# EAGLE design shieldArduinoMega (EAGLE 6.1)
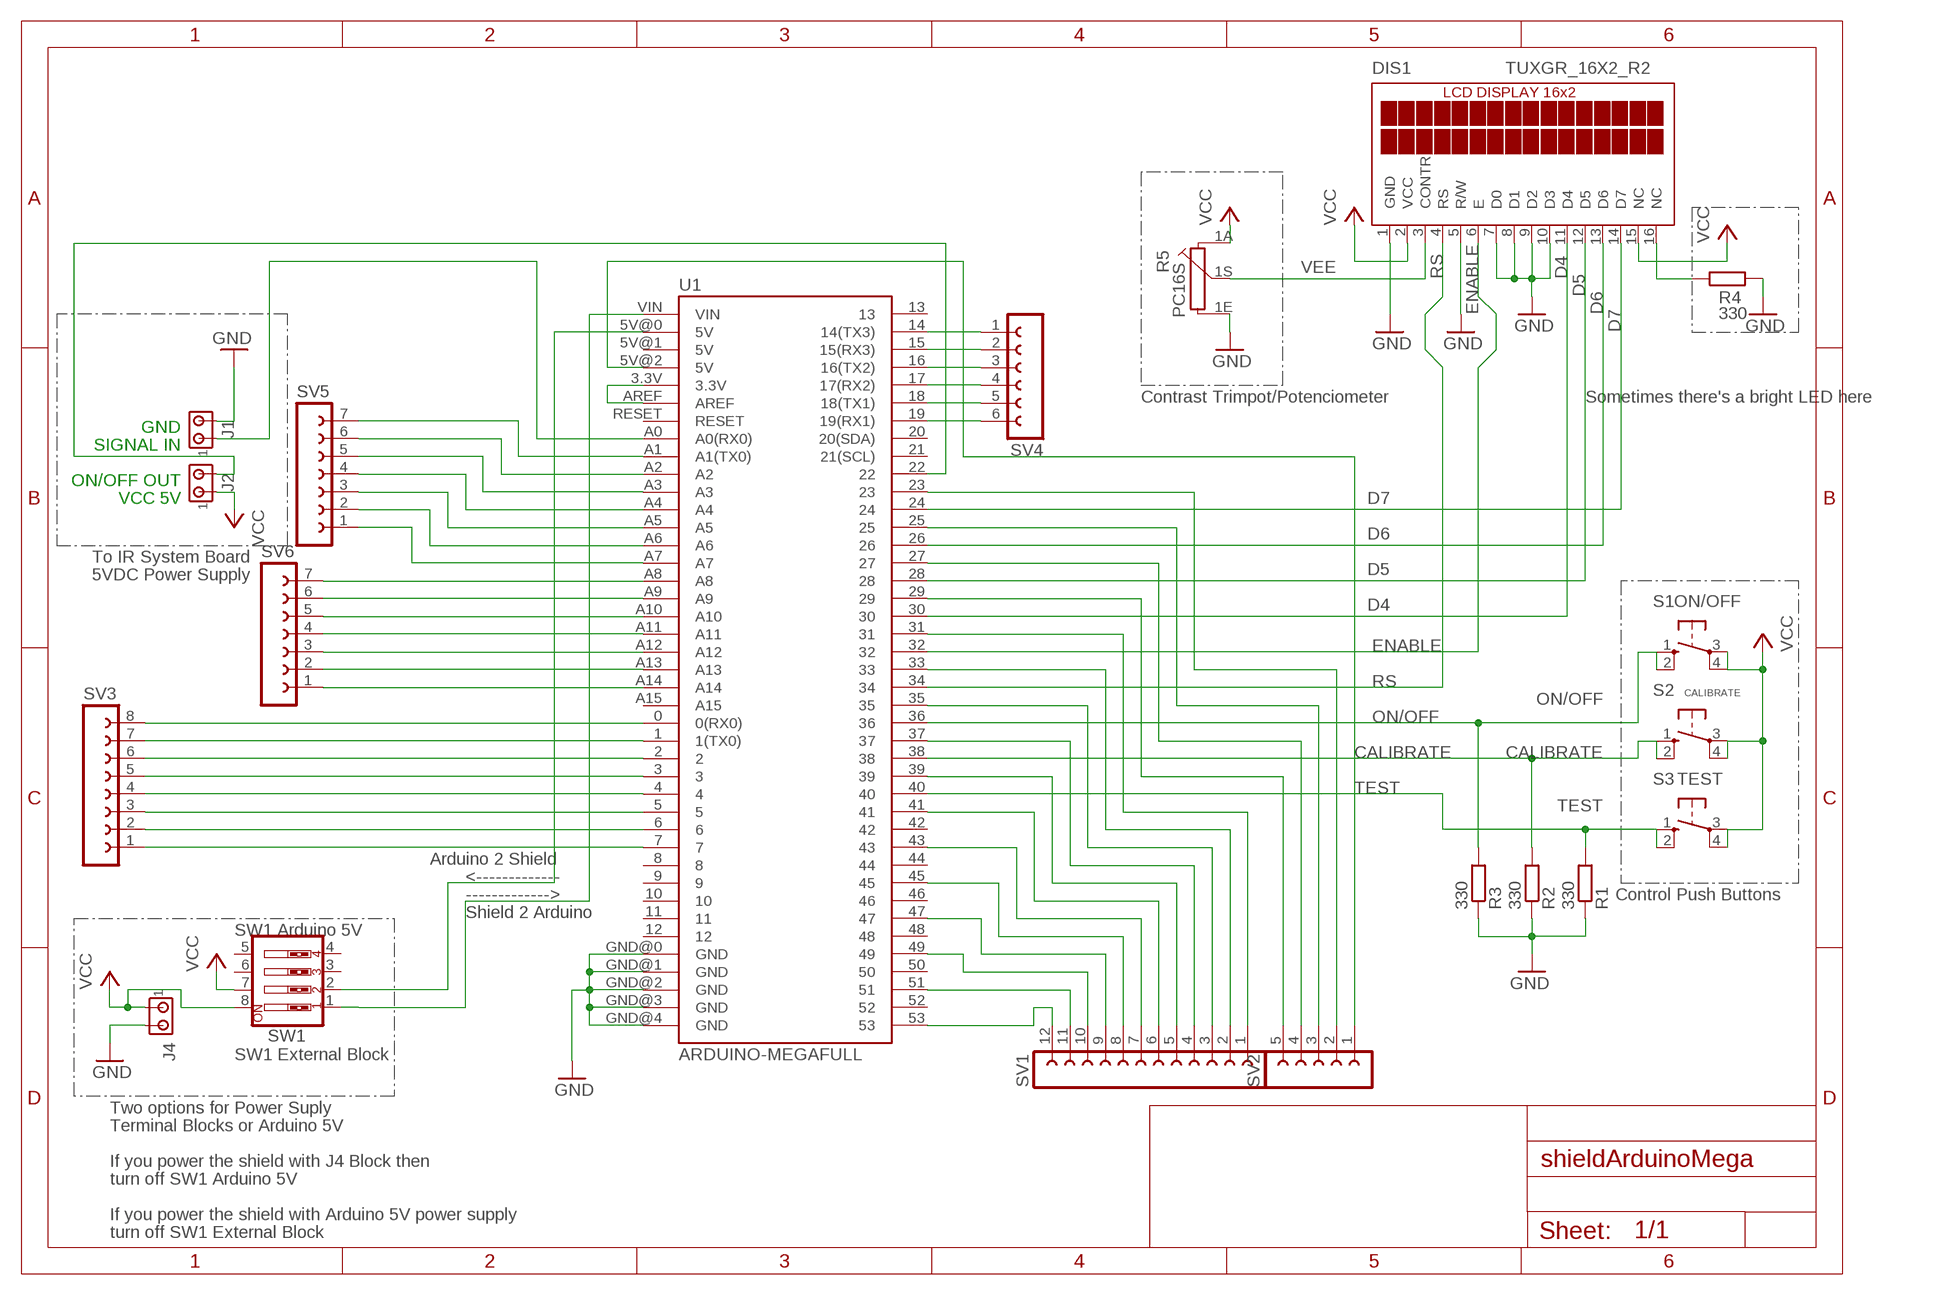
[diagram p0: schematic, sheet 1]

## Parts
DIS1  TUXGR_16X2_R2  [TUXGR_16X2_R2]
J1  MTA02-156  [1X2MTA]
J2  MTA02-156  [1X2MTA]
J4  MTA02-156  [1X2MTA]
R1  330  R-EU_0204/7  [0204/7]
R2  330  R-EU_0204/7  [0204/7]
R3  330  R-EU_0204/7  [0204/7]
R4  330  R-EU_0204/7  [0204/7]
R5  PC16S  [PC16S]
S1  ON/OFF  10-XX  [B3F-10XX]
S2  CALIBRATE  10-XX  [B3F-10XX]
S3  TEST  10-XX  [B3F-10XX]
SV1  FE12-1  [FE12]
SV2  FE05-1  [FE05-1]
SV3  FE08-1  [FE08]
SV4  FE06-1  [FE06]
SV5  FE07-1  [FE07]
SV6  FE07-1  [FE07]
SW1  SW_DIP-4  [EDG-04]
U1  ARDUINO-MEGAFULL  [ARDUINO_MEGA]

## Nets
3.3: U1.3.3V U1.AREF
CALIBRATE: R2.2 S2.1(S) S2.2(S1) U1.38
D4: DIS1.11(D4) U1.30
D5: DIS1.12(D5) U1.28
D6: DIS1.13(D6) U1.26
D7: DIS1.14(D7) U1.24
ENABLE: DIS1.6(E) U1.32
GND: DIS1.1(GND) DIS1.5(R/W) DIS1.7(D0) DIS1.8(D1) DIS1.9(D2) DIS1.10(D3) J1.2 J4.2 R1.1 R2.1 R3.1 R4.2 R5.1E U1.GND@0(GND) U1.GND@1(GND) U1.GND@2(GND) U1.GND@3(GND) U1.GND@4(GND)
IR_ON/OFF: J2.2 U1.22
LED-: DIS1.16(NC) R4.1
N$1: SV1.12 U1.53
N$2: SW1.1 U1.VIN
N$3: SV1.11 U1.51
N$4: SW1.2 U1.5V@0(5V)
N$5: SV1.10 U1.49
N$6: SV1.9 U1.47
N$7: SV1.8 U1.45
N$8: SV1.7 U1.43
N$9: SV1.6 U1.41
N$10: SV1.5 U1.39
N$11: SV1.4 U1.37
N$12: SV1.3 U1.35
N$13: SV1.2 U1.33
N$14: SV1.1 U1.31
N$15: SV2.5 U1.29
N$16: SV2.4 U1.27
N$17: SV2.3 U1.25
N$18: SV2.2 U1.23
N$19: SV2.1 U1.5V@2(5V)
N$20: SV3.8 U1.0(0(RX0))
N$21: SV3.7 U1.1(1(TX0))
N$22: SV3.6 U1.2
N$23: SV3.5 U1.3
N$24: SV3.4 U1.4
N$25: SV3.3 U1.5
N$26: SV3.2 U1.6
N$27: SV3.1 U1.7
N$28: SV4.1 U1.14(14(TX3))
N$29: SV4.2 U1.15(15(RX3))
N$30: SV4.3 U1.16(16(TX2))
N$31: SV4.4 U1.17(17(RX2))
N$32: SV4.5 U1.18(18(TX1))
N$33: SV4.6 U1.19(19(RX1))
N$34: SV5.7 U1.A1(A1(TX0))
N$35: SV5.6 U1.A2
N$36: SV5.5 U1.A3
N$37: SV5.4 U1.A4
N$38: SV5.3 U1.A5
N$39: SV5.2 U1.A6
N$40: SV5.1 U1.A7
N$41: SV6.7 U1.A8
N$42: SV6.6 U1.A9
N$43: SV6.5 U1.A10
N$44: SV6.4 U1.A11
N$45: SV6.3 U1.A12
N$46: SV6.2 U1.A13
N$47: SV6.1 U1.A14
ON/OFF: R3.2 S1.1(S) S1.2(S1) U1.36
RS: DIS1.4(RS) U1.34
SIGNAL_IN: J1.1 U1.A0(A0(RX0))
TEST: R1.2 S3.1(S) S3.2(S1) U1.40
VCC: DIS1.2(VCC) DIS1.15(NC) J2.1 J4.1 R5.1A S1.3(P) S1.4(P1) S2.3(P) S2.4(P1) S3.3(P) S3.4(P1) SW1.7 SW1.8
VEE: DIS1.3(CONTR) R5.1S
Unconnected: SW1.3 SW1.4 SW1.5 SW1.6 U1.5V@1(5V) U1.8 U1.9 U1.10 U1.11 U1.12 U1.13 U1.20(20(SDA)) U1.21(21(SCL)) U1.42 U1.44 U1.46 U1.48 U1.50 U1.52 U1.A15 U1.RESET

## Notes on the sheet
- Contrast Trimpot/Potenciometer | Sometimes there's a bright LED here
- GND
- SIGNAL IN
- ON/OFF OUT
- VCC 5V
- To IR System Board
- 5VDC Power Supply
- Arduino 2 Shield
- <-------------
- -------------> | Control Push Buttons
- Shield 2 Arduino
- SW1 Arduino 5V
- SW1 External Block
- Two options for Power Suply
- Terminal Blocks or Arduino 5V
- If you power the shield with J4 Block then
- turn off SW1 Arduino 5V
- If you power the shield with Arduino 5V power supply
- turn off SW1 External Block

## Library data of the parts
DIS1 = display-lcd:TUXGR_16X2_R2: Tuxgraphics LCD display 16x2 characters reflective, without background light Source: tuxgr_12x2_r2.pdf; OC_FARNELL: unknown; OC_NEWARK: unknown
J1 J2 J4 = con-amp:MTA02-156: AMP connector
R1-R3 = resistor:R-EU_: RESISTOR, European symbol
R4 = rcl:R-EU_: RESISTOR, European symbol
R5 = piher:PC16S: POTENTIOMETER single carbon potentiometer, 16 mm, S3ROH; OC_FARNELL: 4452940; OC_NEWARK: unknown
S1-S3 = switch-omron:10-XX: OMRON SWITCH; MPN: B3F-1000; OC_FARNELL: 176432; OC_NEWARK: 36M3542
SV1 = con-lsta:FE12-1: FEMALE HEADER; OC_FARNELL: unknown; OC_NEWARK: unknown
SV2 = con-lsta:FE05-1: FEMALE HEADER; OC_FARNELL: unknown; OC_NEWARK: unknown
SV3 = con-lsta:FE08-1: FEMALE HEADER; OC_FARNELL: unknown; OC_NEWARK: unknown
SV4 = con-lsta:FE06-1: FEMALE HEADER; OC_FARNELL: unknown; OC_NEWARK: unknown
SV5 SV6 = con-lsta:FE07-1: FEMALE HEADER; OC_FARNELL: unknown; OC_NEWARK: unknown
SW1 = special:SW_DIP-4: DIP SWITCH
U1 = SparkFun-Boards:ARDUINO-MEGA: Arduino Mega board footprint

## Board
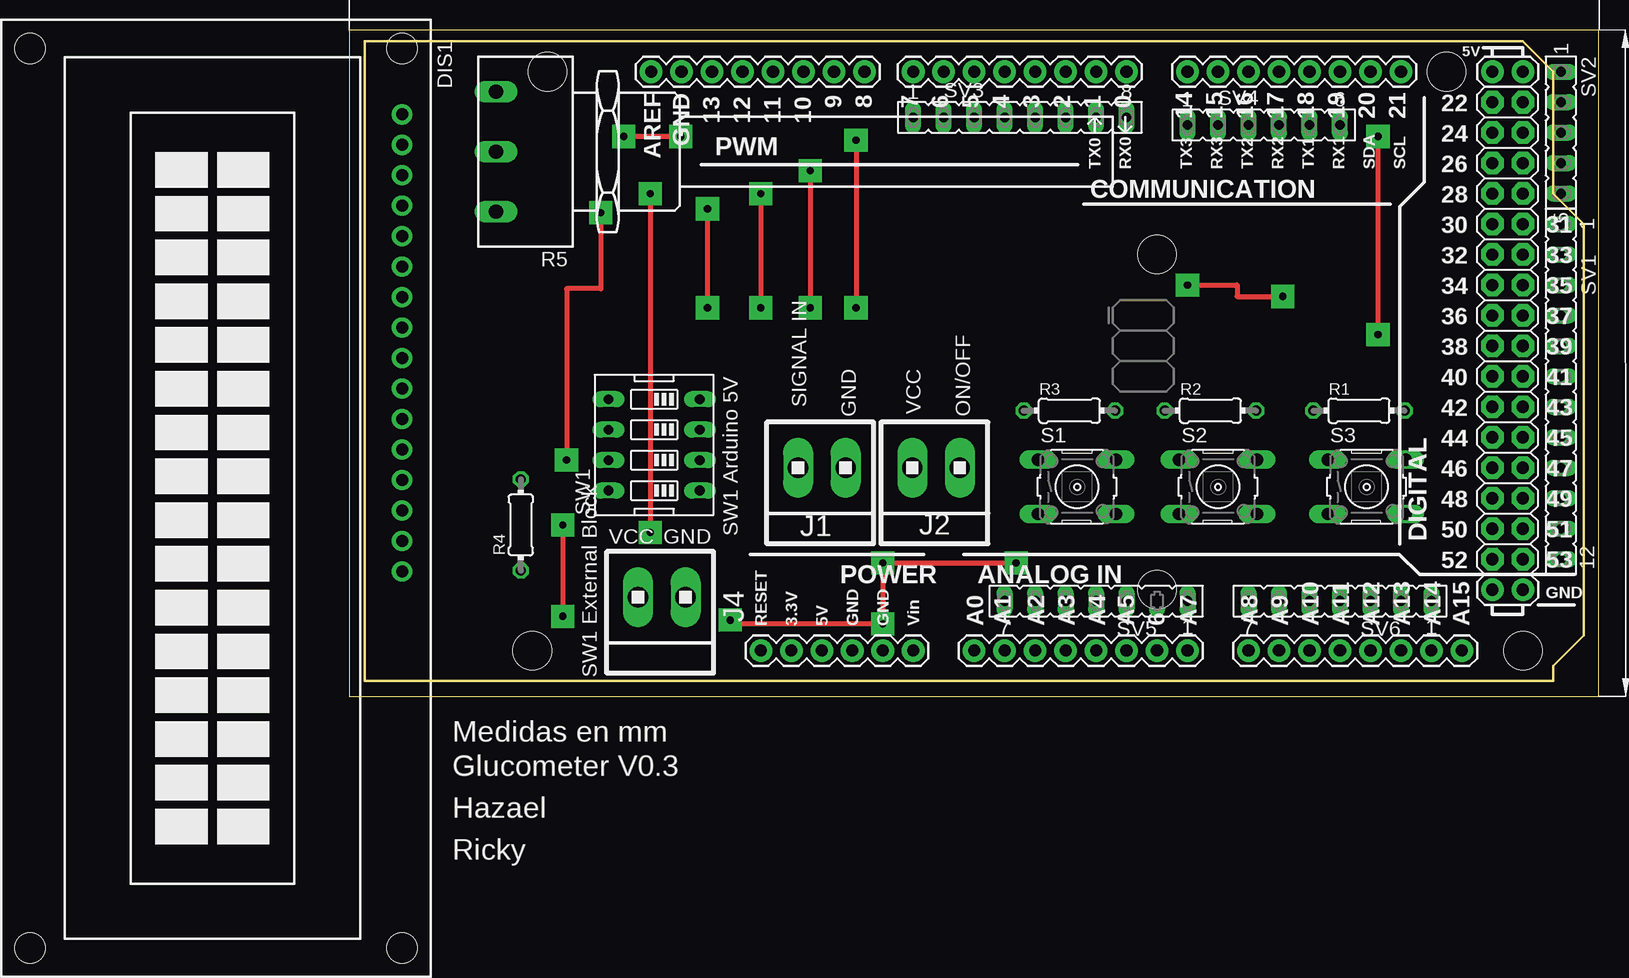
[diagram p1: board, top side]
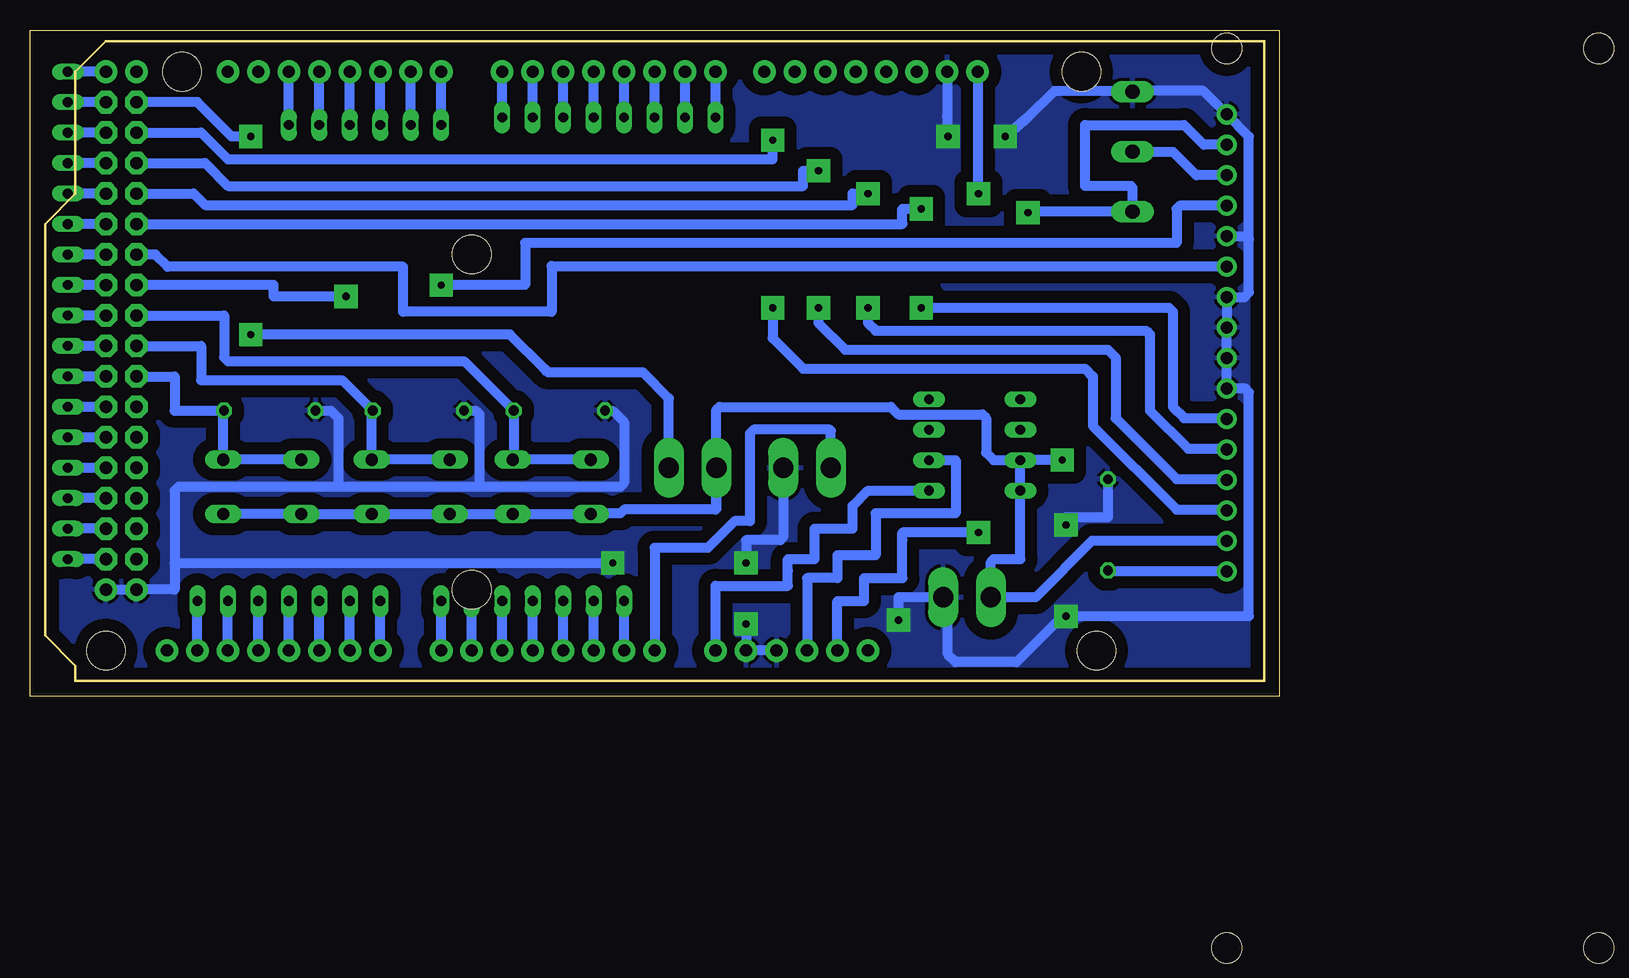
[diagram p2: board, bottom side, seen from below]

Size 104.12 x 55.55 mm. Coordinates in mm from the lower left corner, seen from the top.
Outline: 0,0 104.12,0 104.12,55.55 0,55.55 0,0
Copper layers (1*16): Top 0.035mm / dielectric 1.5mm / Bottom 0.035mm
Design rules: minimum track width 10mil, minimum drill 24mil, track to track 8mil, track to pad 8mil, pad to pad 8mil, via to via 8mil, smd to smd 8mil, copper to edge 40mil, drill to drill 8mil, minimum pad ring 10mil, minimum via ring 8mil, stop-mask expansion 4mil, vias tented up to drill 0mil, thermal gap 10mil

### Footprints (pad centres in the part's own frame; a part is rotated, then mirrored left to right if it is on the bottom)
TUXGR_16X2_R2 = drill 1 pad 1.676: 1 -32,15.5; 2 -29.46,15.5; 3 -26.92,15.5; 4 -24.38,15.5; 5 -21.84,15.5; 6 -19.3,15.5; 7 -16.76,15.5; 8 -14.22,15.5; 9 -11.68,15.5; 10 -9.14,15.5; 11 -6.6,15.5; 12 -4.06,15.5; 13 -1.52,15.5; 14 1.02,15.5; 15 3.56,15.5; 16 6.1,15.5 | hole 2.5: -37.5,-15.5; 37.5,-15.5; -37.5,15.5; 37.5,15.5
1X2MTA = drill 1.676 long: 1 1.981,0; 2 -1.981,0
0204/7 = drill 0.813 octagon: 1 -3.81,0; 2 3.81,0
PC16S = drill 1.2 long: 1A -5,6.5; 1E 5,6.5; 1S 0,6.5
B3F-10XX = drill 1.016 long: 1 -3.251,2.261; 2 3.251,2.261; 3 -3.251,-2.261; 4 3.251,-2.261
FE12 = drill 0.813 long: 1 -13.97,0; 2 -11.43,0; 3 -8.89,0; 4 -6.35,0; 5 -3.81,0; 6 -1.27,0; 7 1.27,0; 8 3.81,0; 9 6.35,0; 10 8.89,0; 11 11.43,0; 12 13.97,0
FE05-1 = drill 0.813 long: 1 -5.08,0; 2 -2.54,0; 3 0,0; 4 2.54,0; 5 5.08,0
FE08 = drill 0.813 long: 1 -8.89,0; 2 -6.35,0; 3 -3.81,0; 4 -1.27,0; 5 1.27,0; 6 3.81,0; 7 6.35,0; 8 8.89,0
FE06 = drill 0.813 long: 1 -6.35,0; 2 -3.81,0; 3 -1.27,0; 4 1.27,0; 5 3.81,0; 6 6.35,0
FE07 = drill 0.813 long: 1 -7.62,0; 2 -5.08,0; 3 -2.54,0; 4 0,0; 5 2.54,0; 6 5.08,0; 7 7.62,0
EDG-04 = drill 0.813 long: 1 -3.81,-3.81; 2 -1.27,-3.81; 3 1.27,-3.81; 4 3.81,-3.81; 5 3.81,3.81; 6 1.27,3.81; 7 -1.27,3.81; 8 -3.81,3.81
ARDUINO_MEGA = drill 1.016 pad 1.88: 0 63.5,50.8; 1 60.96,50.8; 2 58.42,50.8; 3 55.88,50.8; 3.3V 35.56,2.54; 4 53.34,50.8; 5 50.8,50.8; 5V@0 38.1,2.54; 5V@1 93.98,50.8; 5V@2 96.52,50.8; 6 48.26,50.8; 7 45.72,50.8; 8 41.656,50.8; 9 39.116,50.8; 10 36.576,50.8; 11 34.036,50.8; 12 31.496,50.8; 13 28.956,50.8; 14 68.58,50.8; 15 71.12,50.8; 16 73.66,50.8; 17 76.2,50.8; 18 78.74,50.8; 19 81.28,50.8; 20 83.82,50.8; 21 86.36,50.8; A0 50.8,2.54; A1 53.34,2.54; A2 55.88,2.54; A3 58.42,2.54; A4 60.96,2.54; A5 63.5,2.54; A6 66.04,2.54; A7 68.58,2.54; A8 73.66,2.54; A9 76.2,2.54; A10 78.74,2.54; A11 81.28,2.54; A12 83.82,2.54; A13 86.36,2.54; A14 88.9,2.54; A15 91.44,2.54; AREF 23.876,50.8; GND@0 40.64,2.54; GND@1 43.18,2.54; GND@2 93.98,7.62; GND@3 96.52,7.62; GND@4 26.416,50.8; RESET 33.02,2.54; VIN 45.72,2.54 | drill 1.016 pad 1.88 octagon: 22 93.98,48.26; 23 96.52,48.26; 24 93.98,45.72; 25 96.52,45.72; 26 93.98,43.18; 27 96.52,43.18; 28 93.98,40.64; 29 96.52,40.64; 30 93.98,38.1; 31 96.52,38.1; 32 93.98,35.56; 33 96.52,35.56; 34 93.98,33.02; 35 96.52,33.02; 36 93.98,30.48; 37 96.52,30.48; 38 93.98,27.94; 39 96.52,27.94; 40 93.98,25.4; 41 96.52,25.4; 42 93.98,22.86; 43 96.52,22.86; 44 93.98,20.32; 45 96.52,20.32; 46 93.98,17.78; 47 96.52,17.78; 48 93.98,15.24; 49 96.52,15.24; 50 93.98,12.7; 51 96.52,12.7; 52 93.98,10.16; 53 96.52,10.16 | hole 3.2: 15.24,50.8; 13.97,2.54; 66.04,35.56; 66.04,7.62; 90.17,50.8; 96.52,2.54

### Placement (x,y rotation side)
DIS1  -11.11,16.51 270 top
J1  39.37,19.05 180 top
J2  48.9,19.05 180 top
J4  26.04,8.26 180 top
R1  84.14,23.81 0 top
R2  71.75,23.81 0 top
R3  60.01,23.81 0 top
R4  14.29,14.29 90 top
R5  18.73,45.4 90 top
S1  60.64,17.46 0 top
S2  72.39,17.46 0 top
S3  84.77,17.46 0 top
SV1  100.97,25.4 270 top
SV2  100.97,46.99 270 top
SV3  55.88,48.26 0 top
SV4  76.2,47.62 0 top
SV5  62.23,7.94 180 top
SV6  82.55,7.94 180 top
SW1  25.4,20.95 90 top
U1  1.27,1.27 0 top

### Tracks (layer width: path | path; a pad name or v marks a point on that pad's centre or on a via)
3.3  (via drill 0.6 pad 1.93)
  Top 0.406: v25.08,41.91 25.08,33.66 v25.08,13.65
  Bottom 0.406: 25.15,41.97 v25.08,41.91
  Bottom 0.813: U1.AREF 25.15,41.97 | U1.3.3V 36.83,7.94 34.61,7.94 34.61,9.84 31.43,9.84 31.43,13.02 31.43,13.65 v25.08,13.65
CALIBRATE
  Bottom 0.406: 75.64,23.74 R2.2
  Bottom 0.813: S2.1 S2.2 75.64,23.74 | U1.38 89.85,29.21 89.85,26.35 78.11,26.35 R2.2
D4  (via drill 0.6 pad 1.93)
  Top 0.406: v29.84,40.64 v29.84,32.38
  Bottom 0.406: 4.46,23.18 DIS1.11
  Bottom 0.813: U1.30 31.43,39.37 31.43,40.64 v29.84,40.64 | v29.84,32.38 9.21,32.38 8.89,32.07 8.89,24.13 7.94,23.18 4.46,23.18
D5  (via drill 0.6 pad 1.93)
  Top 0.406: v34.29,41.91 v34.29,32.38
  Bottom 0.406: 4.46,20.64 DIS1.12
  Bottom 0.813: v34.29,41.91 35.56,41.91 35.56,40.96 89.53,40.96 90.49,41.91 U1.28 | v34.29,32.38 34.29,31.11 33.66,30.48 11.11,30.48 10.79,30.16 10.79,23.81 7.62,20.64 4.46,20.64
D6  (via drill 0.6 pad 1.93)
  Top 0.406: v38.42,43.81 v38.42,32.38
  Bottom 0.406: 4.46,18.1 DIS1.13
  Bottom 0.813: U1.26 89.53,44.45 87.63,42.55 39.69,42.55 39.69,43.81 v38.42,43.81 | v38.42,32.38 38.42,31.11 36.2,28.89 14.29,28.89 13.65,28.26 13.65,23.18 8.57,18.1 4.46,18.1
D7  (via drill 0.6 pad 1.93)
  Top 0.406: v42.23,46.35 v42.23,32.38
  Bottom 0.406: 4.46,15.56 DIS1.14
  Bottom 0.813: U1.24 89.85,46.99 87.63,44.77 42.23,44.77 v42.23,46.35 | v42.23,32.38 42.23,29.84 39.69,27.3 16.19,27.3 15.56,26.67 15.56,22.54 8.57,15.56 4.46,15.56
ENABLE
  Bottom 0.406: 4.39,35.88 DIS1.6
  Bottom 0.813: U1.32 93.66,36.83 92.64,35.81 73.03,35.81 73.03,32.07 60.64,32.07 60.64,35.88 4.39,35.88
GND  (via drill 0.6 pad 1.93)
  Top 0.406: v17.78,14.29 v17.78,6.67 | v31.75,6.35 32.07,6.03 v44.45,6.03 v44.45,11.11 v55.56,11.11 | v27.62,46.67 v22.86,46.67
  Bottom 0.406: 27.62,7.86 J4.2 | v17.78,6.67 18.1,6.67 | 44.37,11.04 v44.45,11.11 | 94.93,8.89 U1.GND@2 94.93,8.89
  Bottom 0.813: U1.GND@0 U1.GND@1 v44.45,6.03 | J4.2 31.75,8.26 v31.75,6.35 | DIS1.8 DIS1.9 DIS1.10 | 27.62,7.86 27.62,3.49 26.99,2.86 21.91,2.86 18.1,6.67 | R4.2 14.29,14.92 17.78,14.92 v17.78,14.29 | v17.78,6.67 2.54,6.67 2.54,25.33 2.86,25.65 | U1.GND@3 U1.GND@2 | 92.08,11.11 92.08,8.89 94.93,8.89 | 92.08,11.11 v55.56,11.11 | R3.1 55.56,23.81 54.61,22.86 54.61,17.78 54.93,17.46 66.67,17.46 | 66.67,17.46 78.42,17.46 | 78.42,17.46 91.76,17.46 92.08,17.14 92.08,11.11 | R1.1 79.06,23.81 78.42,23.18 78.42,17.46 | R2.1 66.99,23.81 66.67,23.5 66.67,17.46 | J1.2 41.35,13.26 41.59,13.02 44.45,13.02 v44.45,11.11 | 2.79,25.65 2.86,25.65 | 2.86,25.65 4.38,25.65 4.45,25.72 | DIS1.7 2.92,33.27 2.54,33.66 2.54,38.1 | 2.54,38.1 2.54,46.66 DIS1.1 6.35,50.48 12.15,50.48 R5.1E 12.31,50.48 18.73,50.48 20.95,48.26 v22.86,46.67 | DIS1.5 2.79,38.35 2.54,38.1 | U1.GND@4 27.69,48.32 v27.62,46.67
  Bottom 0.82: DIS1.7 DIS1.8
  pour Bottom (isolate 1.016): 103.82,5.4 100.01,1.59 1.59,1.59 1.59,54.29 101.92,54.61 103.82,54.61
IR_ON/OFF  (via drill 0.6 pad 1.93)
  Top 0.406: v85.72,30.16 v85.72,46.67
  Bottom 0.813: J2.2 50.88,24.84 53.02,26.99 60.96,26.99 61.28,27.3 64.14,30.16 v85.72,30.16 | v85.72,46.67 87.31,46.67 90.17,49.53 U1.22
LED-
  Bottom 0.406: 14.22,10.41 R4.1
  Bottom 0.813: DIS1.16 14.22,10.41
N$1
  Bottom 0.813: U1.53 SV1.12
N$2
  Bottom 0.813: U1.VIN 46.99,9.21 40.96,9.21 40.96,10.48 40.96,11.43 38.73,11.43 38.73,13.97 35.56,13.97 35.56,15.88 34.29,17.14 SW1.1
N$3
  Bottom 0.813: U1.51 SV1.11
N$4
  Bottom 0.813: SW1.2 26.99,19.68 26.99,15.24 33.66,15.24 33.66,11.75 36.83,11.75 36.83,9.84 39.37,9.84 U1.5V@0
N$5
  Bottom 0.813: U1.49 SV1.10
N$6
  Bottom 0.813: U1.47 SV1.9
N$7
  Bottom 0.813: U1.45 SV1.8
N$8
  Bottom 0.813: U1.43 SV1.7
N$9
  Bottom 0.813: U1.41 SV1.6
N$10
  Bottom 0.813: U1.39 SV1.5
N$11
  Bottom 0.813: U1.37 SV1.4
N$12
  Bottom 0.813: U1.35 SV1.3
N$13
  Bottom 0.813: U1.33 SV1.2
N$14
  Bottom 0.813: U1.31 SV1.1
N$15
  Bottom 0.813: U1.29 SV2.5
N$16
  Bottom 0.813: U1.27 SV2.4
N$17
  Bottom 0.813: U1.25 SV2.3
N$18
  Bottom 0.813: U1.23 SV2.2
N$19
  Bottom 0.813: U1.5V@2 SV2.1
N$20
  Bottom 0.813: SV3.8 U1.0
N$21
  Bottom 0.813: SV3.7 U1.1
N$22
  Bottom 0.813: SV3.6 U1.2
N$23
  Bottom 0.813: SV3.5 U1.3
N$24
  Bottom 0.813: SV3.4 U1.4
N$25
  Bottom 0.813: SV3.3 U1.5
N$26
  Bottom 0.813: SV3.2 U1.6
N$27
  Bottom 0.813: SV3.1 U1.7
N$28
  Bottom 0.813: SV4.1 U1.14
N$29
  Bottom 0.813: SV4.2 U1.15
N$30
  Bottom 0.813: SV4.3 U1.16
N$31
  Bottom 0.813: SV4.4 U1.17
N$32
  Bottom 0.813: SV4.5 U1.18
N$33
  Bottom 0.813: SV4.6 U1.19
N$34
  Bottom 0.813: U1.A1 SV5.7
N$35
  Bottom 0.813: U1.A2 SV5.6
N$36
  Bottom 0.813: U1.A3 SV5.5
N$37
  Bottom 0.813: U1.A4 SV5.4
N$38
  Bottom 0.813: U1.A5 SV5.3
N$39
  Bottom 0.813: U1.A6 SV5.2
N$40
  Bottom 0.813: U1.A7 SV5.1
N$41
  Bottom 0.813: U1.A8 SV6.7
N$42
  Bottom 0.813: U1.A9 SV6.6
N$43
  Bottom 0.813: U1.A10 SV6.5
N$44
  Bottom 0.813: U1.A11 SV6.4
N$45
  Bottom 0.813: U1.A12 SV6.3
N$46
  Bottom 0.813: U1.A13 SV6.2
N$47
  Bottom 0.813: U1.A14 SV6.1
ON/OFF
  Bottom 0.406: 63.82,19.8 S1.2
  Bottom 0.813: S1.1 S1.2 | 63.82,19.8 R3.2 67.94,27.94 87.63,27.94 87.95,28.26 87.95,31.75 U1.36
RS  (via drill 0.6 pad 1.93)
  Top 0.406: v69.85,34.29 73.98,34.29 73.98,33.34 v77.79,33.34
  Bottom 0.813: DIS1.4 8.32,40.89 8.57,40.64 8.57,37.78 62.87,37.78 62.87,34.29 v69.85,34.29 | v77.79,33.34 83.82,33.34 83.82,34.29 U1.34
SIGNAL_IN
  Bottom 0.406: 37.39,22.15 37.47,22.23
  Bottom 0.813: J1.1 37.39,22.15 | 37.47,22.23 43.81,22.23 44.13,21.91 44.13,14.61 45.4,14.61 47.62,12.38 52.07,12.38 U1.A0
TEST
  Bottom 0.406: 88.02,23.74 R1.2
  Bottom 0.813: S3.1 S3.2 88.02,23.74 | U1.40 92.08,26.67 92.08,23.81 R1.2
VCC  (via drill 0.6 pad 1.93)
  Top 0.406: v20.95,40.32 20.95,33.97 18.1,33.97 v18.1,19.68
  Bottom 0.406: 46.91,15.63 46.99,15.56 | 57.35,15.24 S1.3
  Bottom 0.813: DIS1.15 15.62,12.95 20.32,8.26 J4.1 24.05,11.19 23.81,11.43 21.59,11.43 21.59,17.46 | S1.3 S1.4 S2.3 S2.4 S3.3 S3.4 | J2.1 46.91,15.63 46.91,23.89 46.67,24.13 32.38,24.13 31.75,23.5 24.77,23.5 24.45,23.18 24.45,20.32 23.81,19.68 SW1.7 | 46.99,15.56 54.61,15.56 54.93,15.24 57.35,15.24 | SW1.8 21.59,17.46 | 21.59,17.46 SW1.7 | v20.95,40.32 20.88,40.4 R5.1A 12.23,42.4 12.38,42.55 16.19,42.55 16.19,47.62 7.94,47.62 6.35,46.04 6.28,45.97 DIS1.2 | v18.1,19.68 SW1.7
VEE
  Bottom 0.813: DIS1.3 6.92,43.43 8.89,45.4 R5.1S

### Text on the board
tPlace: Medidas en mm | Glucometer V0.3 | Hazael | Ricky
tNames: ON/OFF | SW1 Arduino 5V | GND | VCC | SIGNAL IN | VCC | GND | SW1 External Block